# Altium schematic sheet Sheet1.SchDoc
size A4
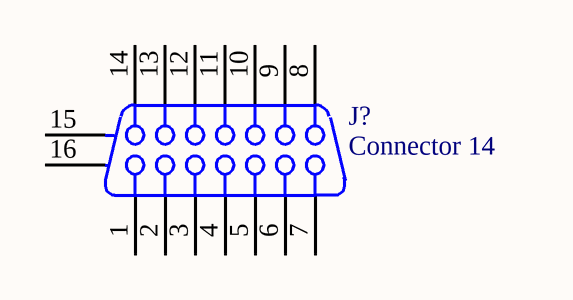
[diagram p0: Sheet1.SchDoc]

## Parts
J?  Connector 14  [CHAMP1.27-2H14A]

## Nets

Not connected (* = marked no-connect by the designer): J? 1 2 3 4 5 6 7 8 9 10 11 12 13 14 15(MH1) 16(MH2)

## Library data of the parts
J? = Connector 14: Receptacle Header Assemby; PackageDocument: B; Positions: 14; Published: 15-Jun-2001; LatestRevisionDate: 17-Jul-2002; LatestRevisionNote: Re-released for DXP Platform.; DatasheetDocument: 1-Oct-1983; PackageReference: 178240-1; Publisher: Altium Limited; Orientation: Right Angle